# EAGLE design X8-Backplane (EAGLE 7.5.0)
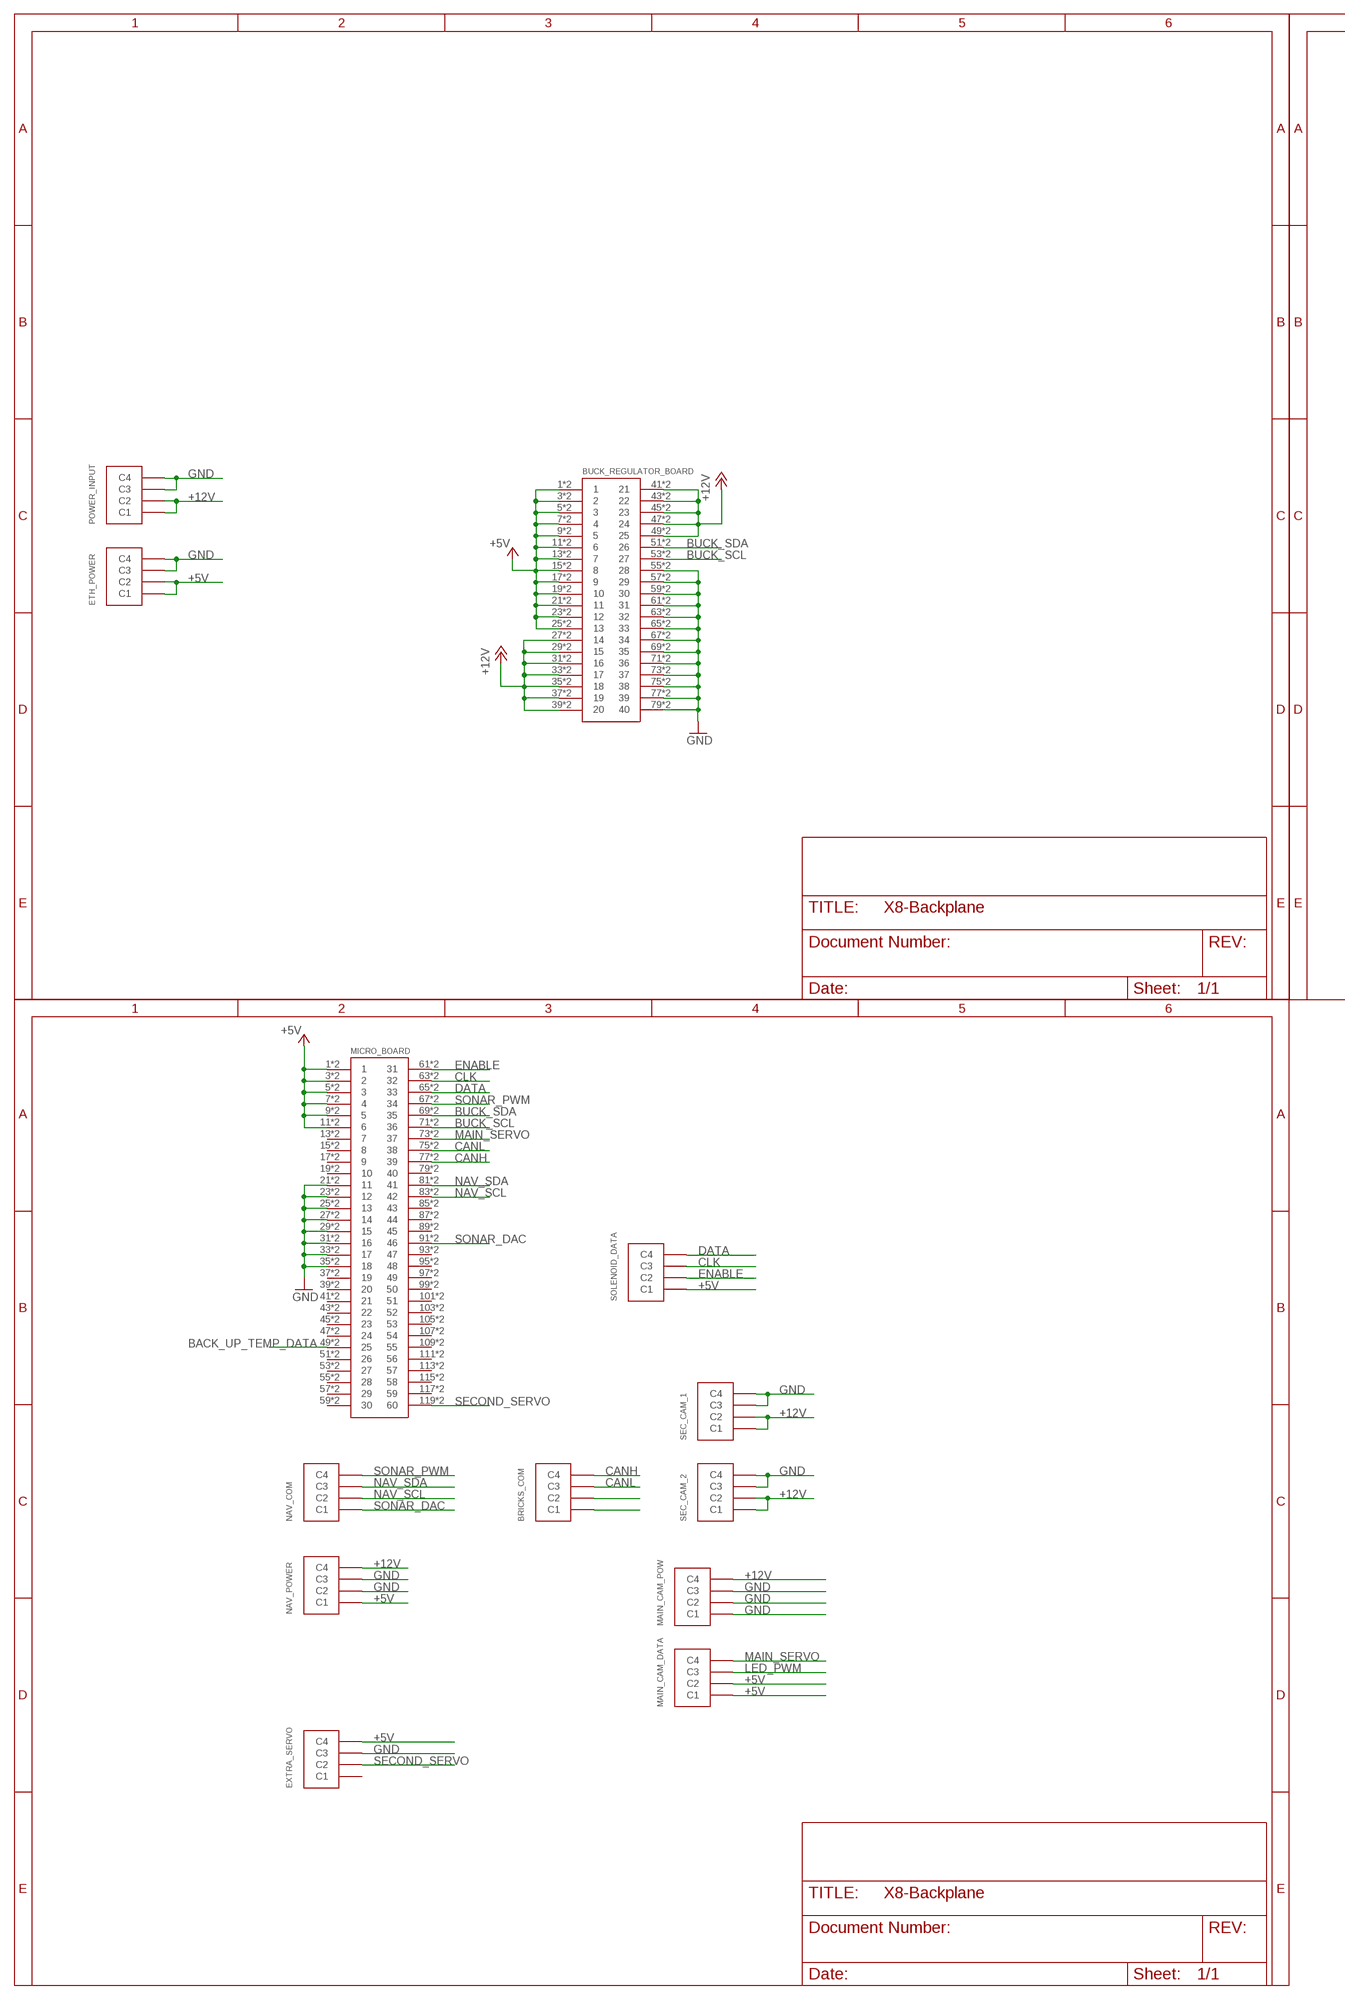
[diagram p0: schematic, sheet 1, part 1 of 2]
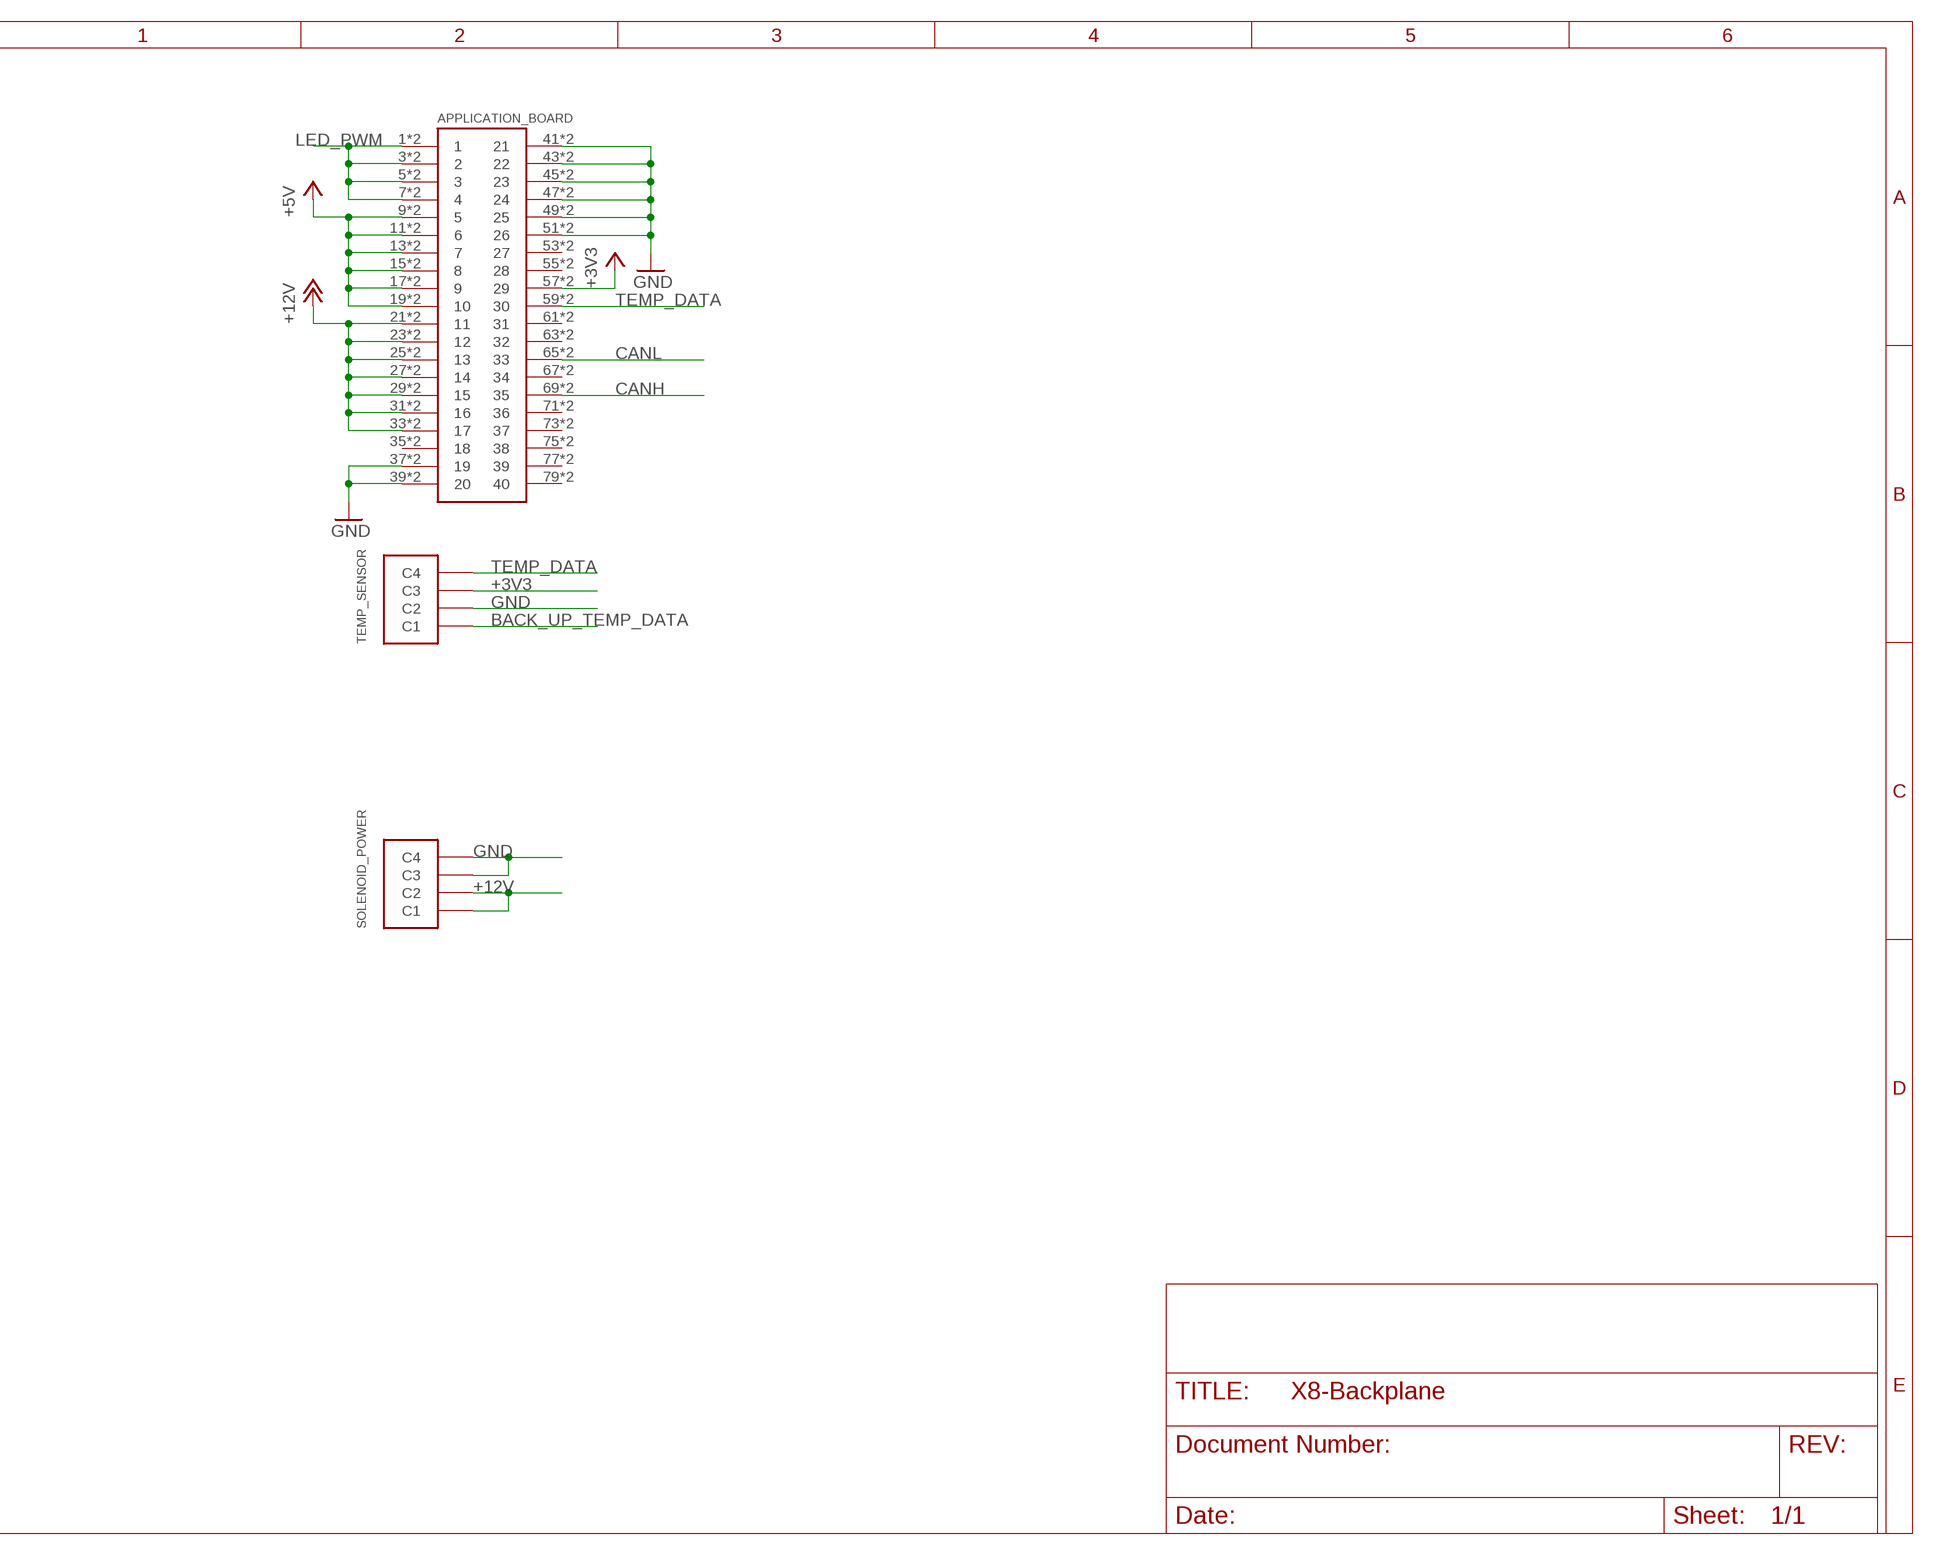
[diagram p1: schematic, sheet 1, part 2 of 2]

## Parts
APPLICATION_BOARD  HSEC8-140-01-XX-DV-A  [HSEC8-140-01-XX-DV-A]
BRICKS_COM  MICRO-FIT-4-SMD-PART  [MICRO-FIT-4-SMD]
BUCK_REGULATOR_BOARD  HSEC8-140-01-XX-DV-A  [HSEC8-140-01-XX-DV-A]
ETH_POWER  MICRO-FIT-4-SMD-PART  [MICRO-FIT-4-SMD]
EXTRA_SERVO  MICRO-FIT-4-SMD-PART  [MICRO-FIT-4-SMD]
MAIN_CAM_DATA  MICRO-FIT-4-SMD-PART  [MICRO-FIT-4-SMD]
MAIN_CAM_POW  MICRO-FIT-4-SMD-PART  [MICRO-FIT-4-SMD]
MICRO_BOARD  HSEC8-160-01-XX-DV-A  [HSEC8-160-01-XX-DV-A]
NAV_COM  MICRO-FIT-4-SMD-PART  [MICRO-FIT-4-SMD]
NAV_POWER  MICRO-FIT-4-SMD-PART  [MICRO-FIT-4-SMD]
POWER_INPUT  MICRO-FIT-4-SMD-PART  [MICRO-FIT-4-SMD]
SEC_CAM_1  MICRO-FIT-4-SMD-PART  [MICRO-FIT-4-SMD]
SEC_CAM_2  MICRO-FIT-4-SMD-PART  [MICRO-FIT-4-SMD]
SOLENOID_DATA  MICRO-FIT-4-SMD-PART  [MICRO-FIT-4-SMD]
SOLENOID_POWER  MICRO-FIT-4-SMD-PART  [MICRO-FIT-4-SMD]
TEMP_SENSOR  MICRO-FIT-4-SMD-PART  [MICRO-FIT-4-SMD]

## Nets
+3V3: APPLICATION_BOARD.57 APPLICATION_BOARD.58 TEMP_SENSOR.C3
+5V: APPLICATION_BOARD.9 APPLICATION_BOARD.10 APPLICATION_BOARD.11 APPLICATION_BOARD.12 APPLICATION_BOARD.13 APPLICATION_BOARD.14 APPLICATION_BOARD.15 APPLICATION_BOARD.16 APPLICATION_BOARD.17 APPLICATION_BOARD.18 APPLICATION_BOARD.19 APPLICATION_BOARD.20 BUCK_REGULATOR_BOARD.1 BUCK_REGULATOR_BOARD.2 BUCK_REGULATOR_BOARD.3 BUCK_REGULATOR_BOARD.4 BUCK_REGULATOR_BOARD.5 BUCK_REGULATOR_BOARD.6 BUCK_REGULATOR_BOARD.7 BUCK_REGULATOR_BOARD.8 BUCK_REGULATOR_BOARD.9 BUCK_REGULATOR_BOARD.10 BUCK_REGULATOR_BOARD.11 BUCK_REGULATOR_BOARD.12 BUCK_REGULATOR_BOARD.13 BUCK_REGULATOR_BOARD.14 BUCK_REGULATOR_BOARD.15 BUCK_REGULATOR_BOARD.16 BUCK_REGULATOR_BOARD.17 BUCK_REGULATOR_BOARD.18 BUCK_REGULATOR_BOARD.19 BUCK_REGULATOR_BOARD.20 BUCK_REGULATOR_BOARD.21 BUCK_REGULATOR_BOARD.22 BUCK_REGULATOR_BOARD.23 BUCK_REGULATOR_BOARD.24 BUCK_REGULATOR_BOARD.25 BUCK_REGULATOR_BOARD.26 ETH_POWER.C1 ETH_POWER.C2 EXTRA_SERVO.C4 MAIN_CAM_DATA.C1 MAIN_CAM_DATA.C2 MICRO_BOARD.1 MICRO_BOARD.2 MICRO_BOARD.3 MICRO_BOARD.4 MICRO_BOARD.5 MICRO_BOARD.6 MICRO_BOARD.7 MICRO_BOARD.8 MICRO_BOARD.9 MICRO_BOARD.10 MICRO_BOARD.11 MICRO_BOARD.12 NAV_POWER.C1 SOLENOID_DATA.C1
+12V: APPLICATION_BOARD.21 APPLICATION_BOARD.22 APPLICATION_BOARD.23 APPLICATION_BOARD.24 APPLICATION_BOARD.25 APPLICATION_BOARD.26 APPLICATION_BOARD.27 APPLICATION_BOARD.28 APPLICATION_BOARD.29 APPLICATION_BOARD.30 APPLICATION_BOARD.31 APPLICATION_BOARD.32 APPLICATION_BOARD.33 APPLICATION_BOARD.34 BUCK_REGULATOR_BOARD.27 BUCK_REGULATOR_BOARD.28 BUCK_REGULATOR_BOARD.29 BUCK_REGULATOR_BOARD.30 BUCK_REGULATOR_BOARD.31 BUCK_REGULATOR_BOARD.32 BUCK_REGULATOR_BOARD.33 BUCK_REGULATOR_BOARD.34 BUCK_REGULATOR_BOARD.35 BUCK_REGULATOR_BOARD.36 BUCK_REGULATOR_BOARD.37 BUCK_REGULATOR_BOARD.38 BUCK_REGULATOR_BOARD.39 BUCK_REGULATOR_BOARD.40 BUCK_REGULATOR_BOARD.41 BUCK_REGULATOR_BOARD.42 BUCK_REGULATOR_BOARD.43 BUCK_REGULATOR_BOARD.44 BUCK_REGULATOR_BOARD.45 BUCK_REGULATOR_BOARD.46 BUCK_REGULATOR_BOARD.47 BUCK_REGULATOR_BOARD.48 BUCK_REGULATOR_BOARD.49 BUCK_REGULATOR_BOARD.50 MAIN_CAM_POW.C4 NAV_POWER.C4 POWER_INPUT.C1 POWER_INPUT.C2 SEC_CAM_1.C1 SEC_CAM_1.C2 SEC_CAM_2.C1 SEC_CAM_2.C2 SOLENOID_POWER.C1 SOLENOID_POWER.C2
BACK_UP_TEMP_DATA: MICRO_BOARD.49 MICRO_BOARD.50 TEMP_SENSOR.C1
BUCK_SCL: BUCK_REGULATOR_BOARD.53 BUCK_REGULATOR_BOARD.54 MICRO_BOARD.71 MICRO_BOARD.72
BUCK_SDA: BUCK_REGULATOR_BOARD.51 BUCK_REGULATOR_BOARD.52 MICRO_BOARD.69 MICRO_BOARD.70
CANH: APPLICATION_BOARD.69 APPLICATION_BOARD.70 BRICKS_COM.C4 MICRO_BOARD.77 MICRO_BOARD.78
CANL: APPLICATION_BOARD.65 APPLICATION_BOARD.66 BRICKS_COM.C3 MICRO_BOARD.75 MICRO_BOARD.76
CLK: MICRO_BOARD.63 MICRO_BOARD.64 SOLENOID_DATA.C3
DATA: MICRO_BOARD.65 MICRO_BOARD.66 SOLENOID_DATA.C4
ENABLE: MICRO_BOARD.61 MICRO_BOARD.62 SOLENOID_DATA.C2
GND: APPLICATION_BOARD.37 APPLICATION_BOARD.38 APPLICATION_BOARD.39 APPLICATION_BOARD.40 APPLICATION_BOARD.41 APPLICATION_BOARD.42 APPLICATION_BOARD.43 APPLICATION_BOARD.44 APPLICATION_BOARD.45 APPLICATION_BOARD.46 APPLICATION_BOARD.47 APPLICATION_BOARD.48 APPLICATION_BOARD.49 APPLICATION_BOARD.50 APPLICATION_BOARD.51 APPLICATION_BOARD.52 BUCK_REGULATOR_BOARD.55 BUCK_REGULATOR_BOARD.56 BUCK_REGULATOR_BOARD.57 BUCK_REGULATOR_BOARD.58 BUCK_REGULATOR_BOARD.59 BUCK_REGULATOR_BOARD.60 BUCK_REGULATOR_BOARD.61 BUCK_REGULATOR_BOARD.62 BUCK_REGULATOR_BOARD.63 BUCK_REGULATOR_BOARD.64 BUCK_REGULATOR_BOARD.65 BUCK_REGULATOR_BOARD.66 BUCK_REGULATOR_BOARD.67 BUCK_REGULATOR_BOARD.68 BUCK_REGULATOR_BOARD.69 BUCK_REGULATOR_BOARD.70 BUCK_REGULATOR_BOARD.71 BUCK_REGULATOR_BOARD.72 BUCK_REGULATOR_BOARD.73 BUCK_REGULATOR_BOARD.74 BUCK_REGULATOR_BOARD.75 BUCK_REGULATOR_BOARD.76 BUCK_REGULATOR_BOARD.77 BUCK_REGULATOR_BOARD.78 BUCK_REGULATOR_BOARD.79 BUCK_REGULATOR_BOARD.80 ETH_POWER.C3 ETH_POWER.C4 EXTRA_SERVO.C3 MAIN_CAM_POW.C1 MAIN_CAM_POW.C2 MAIN_CAM_POW.C3 MICRO_BOARD.21 MICRO_BOARD.22 MICRO_BOARD.23 MICRO_BOARD.24 MICRO_BOARD.25 MICRO_BOARD.26 MICRO_BOARD.27 MICRO_BOARD.28 MICRO_BOARD.29 MICRO_BOARD.30 MICRO_BOARD.31 MICRO_BOARD.32 MICRO_BOARD.33 MICRO_BOARD.34 MICRO_BOARD.35 MICRO_BOARD.36 NAV_POWER.C2 NAV_POWER.C3 POWER_INPUT.C3 POWER_INPUT.C4 SEC_CAM_1.C3 SEC_CAM_1.C4 SEC_CAM_2.C3 SEC_CAM_2.C4 SOLENOID_POWER.C3 SOLENOID_POWER.C4 TEMP_SENSOR.C2
LED_PWM: APPLICATION_BOARD.1 APPLICATION_BOARD.2 APPLICATION_BOARD.3 APPLICATION_BOARD.4 APPLICATION_BOARD.5 APPLICATION_BOARD.6 APPLICATION_BOARD.7 APPLICATION_BOARD.8 MAIN_CAM_DATA.C3
MAIN_SERVO: MAIN_CAM_DATA.C4 MICRO_BOARD.73 MICRO_BOARD.74
N$3: BRICKS_COM.C2
N$5: BRICKS_COM.C1
NAV_SCL: MICRO_BOARD.83 MICRO_BOARD.84 NAV_COM.C2
NAV_SDA: MICRO_BOARD.81 MICRO_BOARD.82 NAV_COM.C3
SECOND_SERVO: EXTRA_SERVO.C2 MICRO_BOARD.119 MICRO_BOARD.120
SONAR_DAC: MICRO_BOARD.91 MICRO_BOARD.92 NAV_COM.C1
SONAR_PWM: MICRO_BOARD.67 MICRO_BOARD.68 NAV_COM.C4
TEMP_DATA: APPLICATION_BOARD.59 APPLICATION_BOARD.60 TEMP_SENSOR.C4
Unconnected: APPLICATION_BOARD.35 APPLICATION_BOARD.36 APPLICATION_BOARD.53 APPLICATION_BOARD.54 APPLICATION_BOARD.55 APPLICATION_BOARD.56 APPLICATION_BOARD.61 APPLICATION_BOARD.62 APPLICATION_BOARD.63 APPLICATION_BOARD.64 APPLICATION_BOARD.67 APPLICATION_BOARD.68 APPLICATION_BOARD.71 APPLICATION_BOARD.72 APPLICATION_BOARD.73 APPLICATION_BOARD.74 APPLICATION_BOARD.75 APPLICATION_BOARD.76 APPLICATION_BOARD.77 APPLICATION_BOARD.78 APPLICATION_BOARD.79 APPLICATION_BOARD.80 EXTRA_SERVO.C1 MICRO_BOARD.13 MICRO_BOARD.14 MICRO_BOARD.15 MICRO_BOARD.16 MICRO_BOARD.17 MICRO_BOARD.18 MICRO_BOARD.19 MICRO_BOARD.20 MICRO_BOARD.37 MICRO_BOARD.38 MICRO_BOARD.39 MICRO_BOARD.40 MICRO_BOARD.41 MICRO_BOARD.42 MICRO_BOARD.43 MICRO_BOARD.44 MICRO_BOARD.45 MICRO_BOARD.46 MICRO_BOARD.47 MICRO_BOARD.48 MICRO_BOARD.51 MICRO_BOARD.52 MICRO_BOARD.53 MICRO_BOARD.54 MICRO_BOARD.55 MICRO_BOARD.56 MICRO_BOARD.57 MICRO_BOARD.58 MICRO_BOARD.59 MICRO_BOARD.60 MICRO_BOARD.79 MICRO_BOARD.80 MICRO_BOARD.85 MICRO_BOARD.86 MICRO_BOARD.87 MICRO_BOARD.88 MICRO_BOARD.89 MICRO_BOARD.90 MICRO_BOARD.93 MICRO_BOARD.94 MICRO_BOARD.95 MICRO_BOARD.96 MICRO_BOARD.97 MICRO_BOARD.98 MICRO_BOARD.99 MICRO_BOARD.100 MICRO_BOARD.101 MICRO_BOARD.102 MICRO_BOARD.103 MICRO_BOARD.104 MICRO_BOARD.105 MICRO_BOARD.106 MICRO_BOARD.107 MICRO_BOARD.108 MICRO_BOARD.109 MICRO_BOARD.110 MICRO_BOARD.111 MICRO_BOARD.112 MICRO_BOARD.113 MICRO_BOARD.114 MICRO_BOARD.115 MICRO_BOARD.116 MICRO_BOARD.117 MICRO_BOARD.118

## Library data of the parts
APPLICATION_BOARD BUCK_REGULATOR_BOARD = HSEC8-1xx-01-XX-DV-A:HSEC8-140-01-XX-DV-A
BRICKS_COM ETH_POWER EXTRA_SERVO MAIN_CAM_DATA MAIN_CAM_POW NAV_COM NAV_POWER POWER_INPUT SEC_CAM_1 SEC_CAM_2 SOLENOID_DATA SOLENOID_POWER TEMP_SENSOR = Connectors:MICRO-FIT-4-SMD: 4 Pin Molex connector; DIGIKEY-CONTACT-PN: WM1125CT-ND; DIGIKEY-FEMALE-PN: WM2640CT-ND; DIGIKEY-MALE-PN: WM1847-ND
MICRO_BOARD = HSEC8-1xx-01-XX-DV-A:HSEC8-160-01-XX-DV-A

## Board
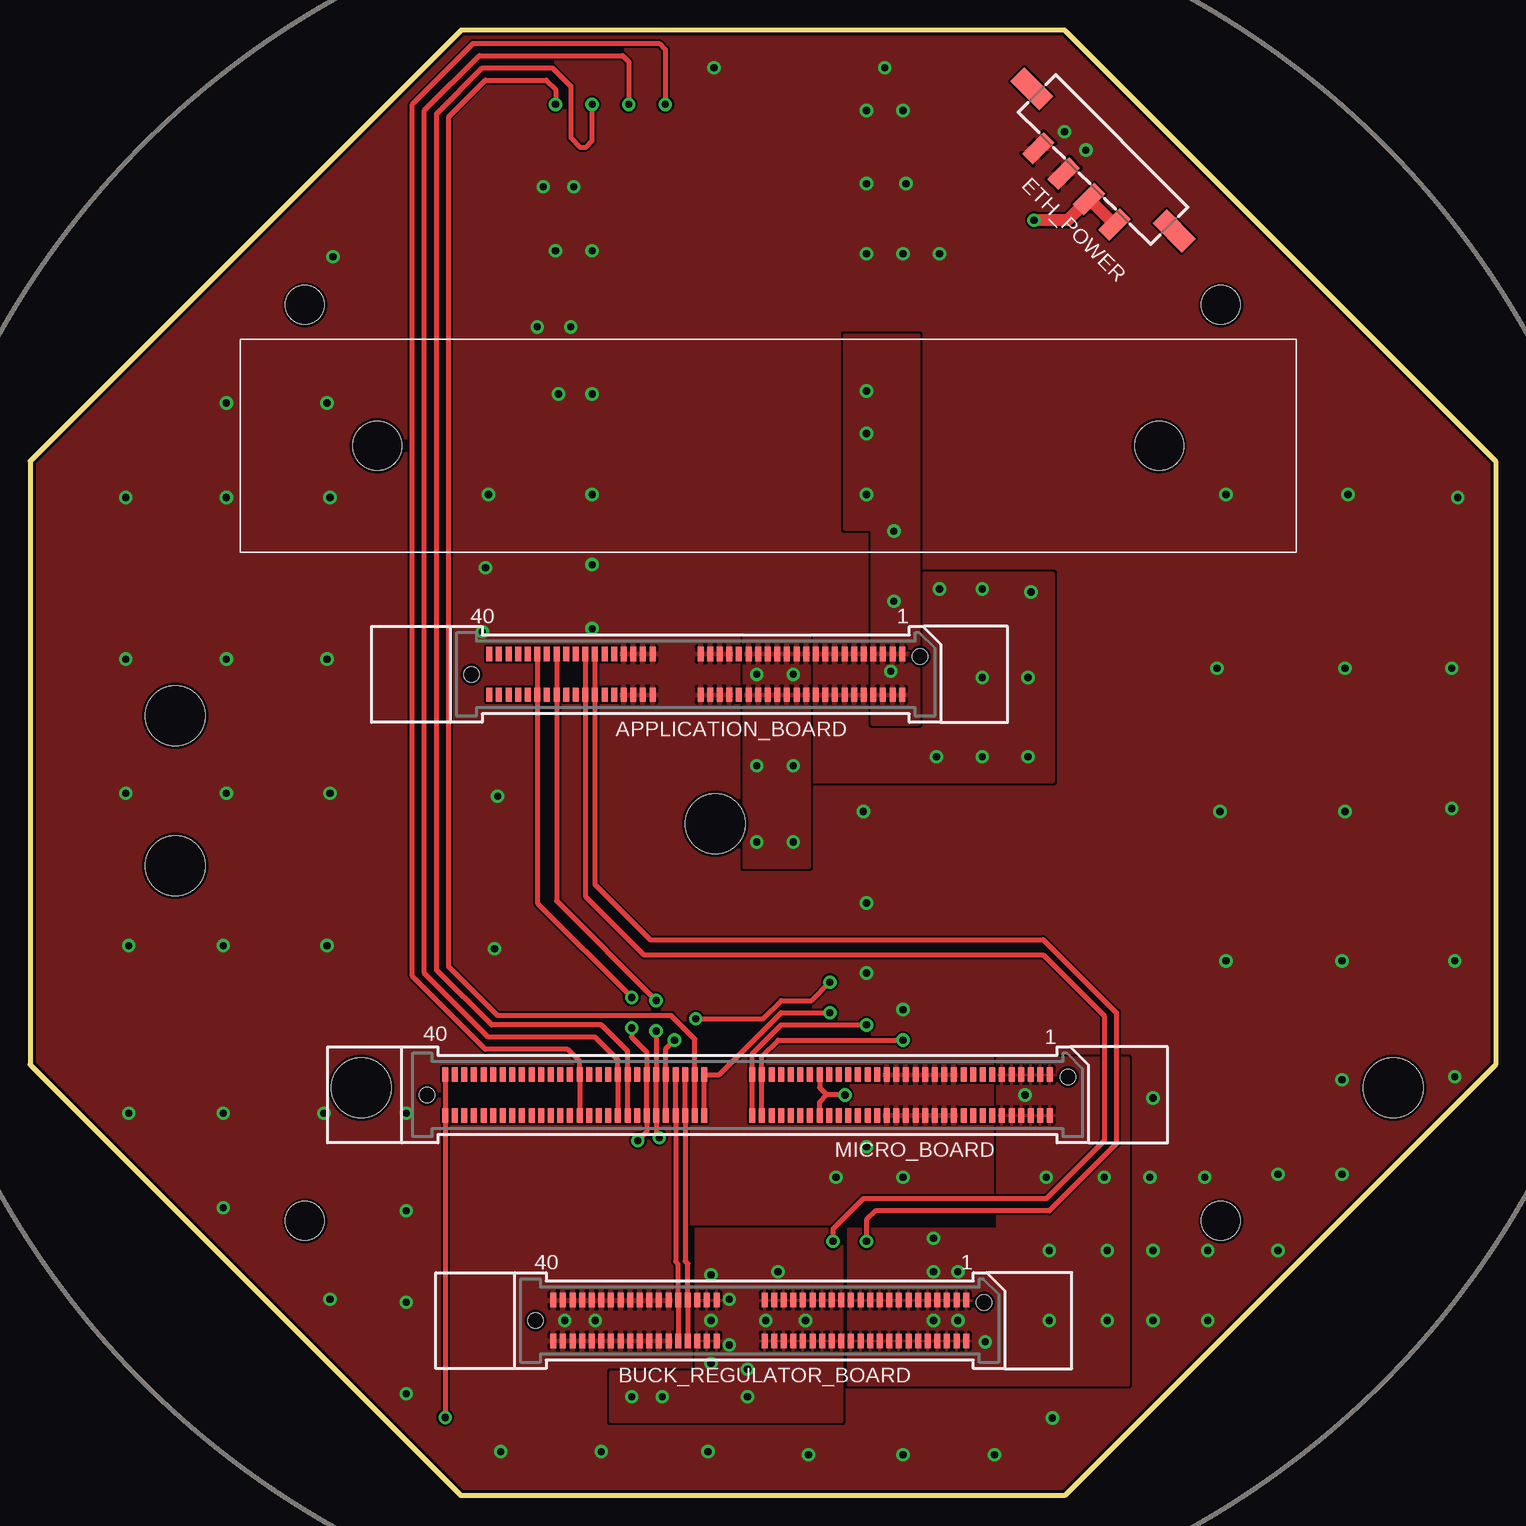
[diagram p2: board, top side]
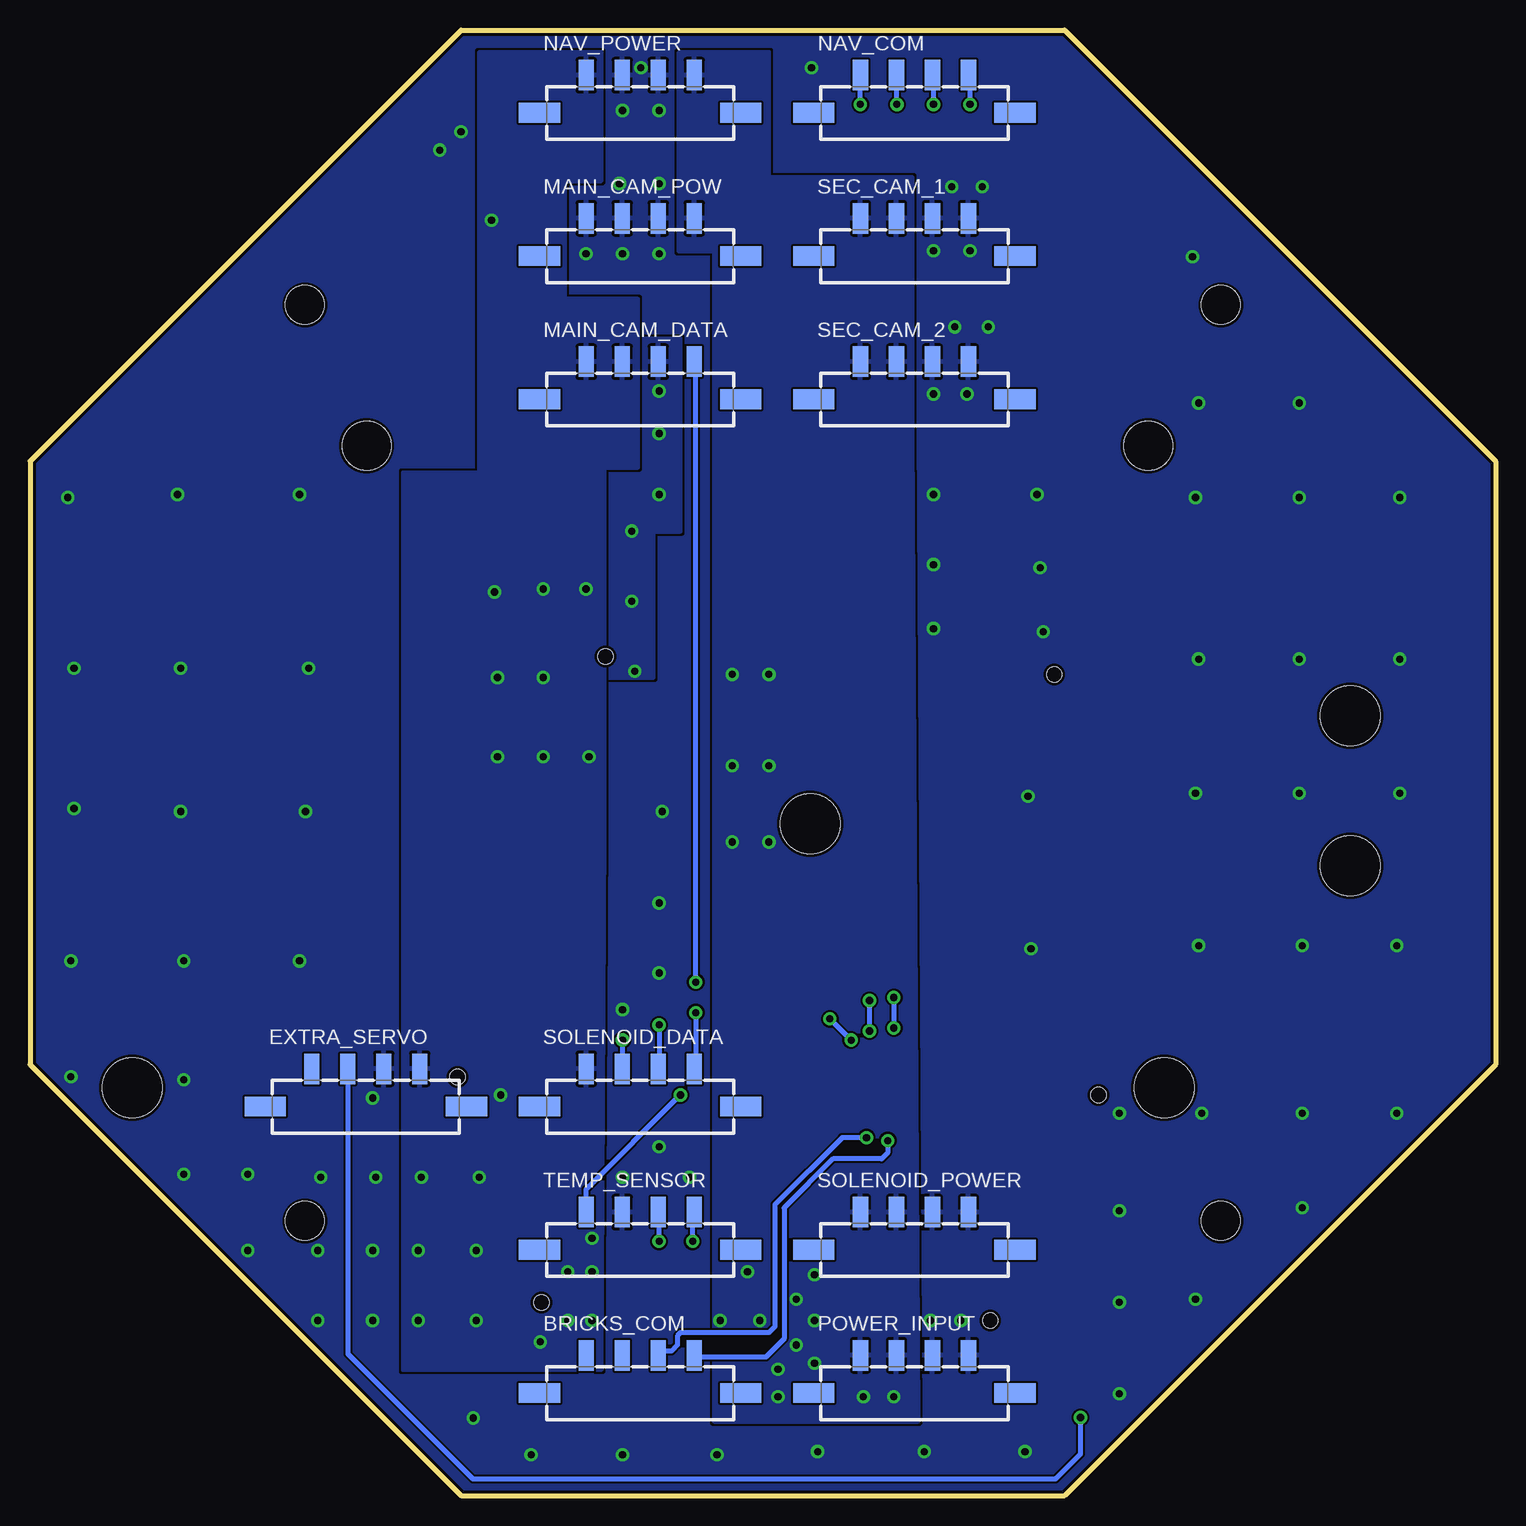
[diagram p3: board, bottom side, seen from below]

Size 122.13 x 122.13 mm. Coordinates in mm from the lower left corner, seen from the top.
Outline: 35.92,122.13 0,86.21 0,35.92 35.92,0 86.21,0 122.13,35.92 122.13,86.21 86.21,122.13 35.92,122.13
Copper layers (1*16): Top 0.035mm / dielectric 1.5mm / Bottom 0.035mm
Design rules "GoldPhoenix": minimum track width 7mil, minimum drill 10mil, track to track 7mil, track to pad 7mil, pad to pad 7mil, via to via 7mil, smd to smd 7mil, copper to edge 10mil, drill to drill 8mil, minimum pad ring 10mil, minimum via ring 10mil, stop-mask expansion 4mil, vias tented up to drill 25mil, thermal gap 10mil
Holes 3.2 mm at 22.9,99.23 22.9,22.9 99.23,22.9 99.23,99.23
Holes 5 mm at 27.61,33.98 12.11,52.48 12.11,64.98 113.61,33.98 57.11,55.98

### Footprints (pad centres in the part's own frame; a part is rotated, then mirrored left to right if it is on the bottom)
HSEC8-140-01-XX-DV-A = smd 0.5 x 1.2: 1 -17.2,-1.7; 2 -17.2,1.7; 3 -16.4,-1.7; 4 -16.4,1.7; 5 -15.6,-1.7; 6 -15.6,1.7; 7 -14.8,-1.7; 8 -14.8,1.7; 9 -14,-1.7; 10 -14,1.7; 11 -13.2,-1.7; 12 -13.2,1.7; 13 -12.4,-1.7; 14 -12.4,1.7; 15 -11.6,-1.7; 16 -11.6,1.7; 17 -10.8,-1.7; 18 -10.8,1.7; 19 -10,-1.7; 20 -10,1.7; 21 -9.2,-1.7; 22 -9.2,1.7; 23 -8.4,-1.7; 24 -8.4,1.7; 25 -7.6,-1.7; 26 -7.6,1.7; 27 -6.8,-1.7; 28 -6.8,1.7; 29 -6,-1.7; 30 -6,1.7; 31 -5.2,-1.7; 32 -5.2,1.7; 33 -4.4,-1.7; 34 -4.4,1.7; 35 -3.6,-1.7; 36 -3.6,1.7; 37 -2.8,-1.7; 38 -2.8,1.7; 39 -2,-1.7; 40 -2,1.7; 41 -1.2,-1.7; 42 -1.2,1.7; 43 -0.4,-1.7; 44 -0.4,1.7; 45 3.6,-1.7; 46 3.6,1.7; 47 4.4,-1.7; 48 4.4,1.7; 49 5.2,-1.7; 50 5.2,1.7; 51 6,-1.7; 52 6,1.7; 53 6.8,-1.7; 54 6.8,1.7; 55 7.6,-1.7; 56 7.6,1.7; 57 8.4,-1.7; 58 8.4,1.7; 59 9.2,-1.7; 60 9.2,1.7; 61 10,-1.7; 62 10,1.7; 63 10.8,-1.7; 64 10.8,1.7; 65 11.6,-1.7; 66 11.6,1.7; 67 12.4,-1.7; 68 12.4,1.7; 69 13.2,-1.7; 70 13.2,1.7; 71 14,-1.7; 72 14,1.7; 73 14.8,-1.7; 74 14.8,1.7; 75 15.6,-1.7; 76 15.6,1.7; 77 16.4,-1.7; 78 16.4,1.7; 79 17.2,-1.7; 80 17.2,1.7 | hole 1.27: -18.7,-1.5; 18.7,0
MICRO-FIT-4-SMD = smd 1.27 x 2.54: C1 5.6,3.955; C2 8.6,3.955; C3 11.6,3.955; C4 14.6,3.955 | smd 3.43 x 1.65: NC1 1.715,0.825; NC2 18.485,0.825
HSEC8-160-01-XX-DV-A = smd 0.5 x 1.2: 1 -25.2,-1.7; 2 -25.2,1.7; 3 -24.4,-1.7; 4 -24.4,1.7; 5 -23.6,-1.7; 6 -23.6,1.7; 7 -22.8,-1.7; 8 -22.8,1.7; 9 -22,-1.7; 10 -22,1.7; 11 -21.2,-1.7; 12 -21.2,1.7; 13 -20.4,-1.7; 14 -20.4,1.7; 15 -19.6,-1.7; 16 -19.6,1.7; 17 -18.8,-1.7; 18 -18.8,1.7; 19 -18,-1.7; 20 -18,1.7; 21 -17.2,-1.7; 22 -17.2,1.7; 23 -16.4,-1.7; 24 -16.4,1.7; 25 -15.6,-1.7; 26 -15.6,1.7; 27 -14.8,-1.7; 28 -14.8,1.7; 29 -14,-1.7; 30 -14,1.7; 31 -13.2,-1.7; 32 -13.2,1.7; 33 -12.4,-1.7; 34 -12.4,1.7; 35 -11.6,-1.7; 36 -11.6,1.7; 37 -10.8,-1.7; 38 -10.8,1.7; 39 -10,-1.7; 40 -10,1.7; 41 -9.2,-1.7; 42 -9.2,1.7; 43 -8.4,-1.7; 44 -8.4,1.7; 45 -7.6,-1.7; 46 -7.6,1.7; 47 -6.8,-1.7; 48 -6.8,1.7; 49 -6,-1.7; 50 -6,1.7; 51 -5.2,-1.7; 52 -5.2,1.7; 53 -4.4,-1.7; 54 -4.4,1.7; 55 -3.6,-1.7; 56 -3.6,1.7; 57 -2.8,-1.7; 58 -2.8,1.7; 59 -2,-1.7; 60 -2,1.7; 61 -1.2,-1.7; 62 -1.2,1.7; 63 -0.4,-1.7; 64 -0.4,1.7; 65 3.6,-1.7; 66 3.6,1.7; 67 4.4,-1.7; 68 4.4,1.7; 69 5.2,-1.7; 70 5.2,1.7; 71 6,-1.7; 72 6,1.7; 73 6.8,-1.7; 74 6.8,1.7; 75 7.6,-1.7; 76 7.6,1.7; 77 8.4,-1.7; 78 8.4,1.7; 79 9.2,-1.7; 80 9.2,1.7; 81 10,-1.7; 82 10,1.7; 83 10.8,-1.7; 84 10.8,1.7; 85 11.6,-1.7; 86 11.6,1.7; 87 12.4,-1.7; 88 12.4,1.7; 89 13.2,-1.7; 90 13.2,1.7; 91 14,-1.7; 92 14,1.7; 93 14.8,-1.7; 94 14.8,1.7; 95 15.6,-1.7; 96 15.6,1.7; 97 16.4,-1.7; 98 16.4,1.7; 99 17.2,-1.7; 100 17.2,1.7; 101 18,-1.7; 102 18,1.7; 103 18.8,-1.7; 104 18.8,1.7; 105 19.6,-1.7; 106 19.6,1.7; 107 20.4,-1.7; 108 20.4,1.7; 109 21.2,-1.7; 110 21.2,1.7; 111 22,-1.7; 112 22,1.7; 113 22.8,-1.7; 114 22.8,1.7; 115 23.6,-1.7; 116 23.6,1.7; 117 24.4,-1.7; 118 24.4,1.7; 119 25.2,-1.7; 120 25.2,1.7 | hole 1.27: -26.7,-1.5; 26.7,0
ETH_SWITCH = hole 4.064: 76.581,8.89; 11.43,8.89

### Placement (x,y rotation side)
APPLICATION_BOARD  55.48,68.43 180 top
BRICKS_COM  81.39,7.73 0 bottom
BUCK_REGULATOR_BOARD  60.81,14.59 180 top
ETH_POWER  97.13,104.76 135 top
EXTRA_SERVO  104.25,31.6 0 bottom
MAIN_CAM_DATA  81.39,90.53 0 bottom
MAIN_CAM_POW  81.39,102.47 0 bottom
MICRO_BOARD  59.8,33.38 180 top
NAV_COM  58.53,114.41 0 bottom
NAV_POWER  81.39,114.41 0 bottom
POWER_INPUT  58.53,7.73 0 bottom
SEC_CAM_1  58.53,102.47 0 bottom
SEC_CAM_2  58.53,90.53 0 bottom
SOLENOID_DATA  81.39,31.6 0 bottom
SOLENOID_POWER  58.53,19.67 0 bottom
TEMP_SENSOR  81.39,19.67 0 bottom
U$18  [ETH_SWITCH]  105.52,96.37 180 top

### Tracks (layer width: path | path; a pad name or v marks a point on that pad's centre or on a via)
+3V3  (via drill 0.6)
  Top 0.406: APPLICATION_BOARD.57 APPLICATION_BOARD.58 47.08,50.93 51.67,46.34 84.43,46.34 90.53,40.24 90.53,29.32 84.94,23.73 70.46,23.73 69.7,22.97 v69.7,21.19
  Bottom 0.406: v69.7,21.19 69.7,23.54 TEMP_SENSOR.C3
+5V  (via drill 0.6)
  Top 1.016: ETH_POWER.C1 ETH_POWER.C2 86.5,106.28 v83.67,106.28
  other vias: 84.94,20.43 75.29,14.59 77.32,14.59 75.29,18.65 77.32,18.65 75.29,21.44 89.77,20.43 84.94,14.59 89.77,14.59 79.61,12.81 84.69,26.52 89.51,26.52 82.91,33.38 75.8,75.55 83.42,75.29 79.35,68.18 79.35,75.55 83.16,68.18 83.16,61.58 79.35,61.58 75.54,61.58
  pour Bottom: 91.04,10.52 74.53,10.52 74.27,55.48 91.04,55.48
  pour Bottom: 74.27,53.96 74.27,85.71 71.48,85.71 71.48,99.68 77.58,99.68 77.58,109.58 74.53,109.58 74.53,120.25 84.69,120.25 84.69,85.2 91.04,85.2 91.04,53.96
  pour Top: 68.18,22.21 68.18,9.25 91.55,9.25 91.55,22.21
  pour Top: 80.62,36.43 80.62,21.95 91.55,21.95 91.55,36.43
  pour Top (rank 4): 65.38,71.48 69.96,71.48 69.96,63.86 74.53,63.86 74.53,76.82 85.2,76.82 85.2,59.54 65.38,59.54
+12V  (via drill 0.6)
  other vias: 56.75,14.59 58.27,16.36 58.27,12.55 56.75,11.03 56.75,18.4 50.14,8.24 52.68,8.24 61.32,14.59 64.62,14.59 59.8,10.52 59.8,8.24 60.56,68.43 63.61,68.43 60.56,60.81 63.61,60.81 60.56,54.46 63.61,54.46 62.34,18.65
  pour Bottom (rank 2): 60.56,120.25 68.05,120.22 68.05,103.71 65.13,103.74 65.13,87.99 48.62,87.99 48.62,109.84 60.56,109.84
  pour Bottom (rank 2): 48.11,6.2 48.62,88.75 65.13,88.5 65.13,6.2
  pour Top (rank 2): 67.67,6.2 67.67,22.21 55.48,22.21 55.48,10.27 48.37,10.27 48.37,6.2
  pour Top (rank 3): 59.54,71.48 59.54,52.43 64.88,52.43 64.88,71.48
BACK_UP_TEMP_DATA  (via drill 0.6)
  Top 0.406: v67.92,33.38 66.4,33.38 | MICRO_BOARD.49 65.8,33.99 66.4,33.38 | MICRO_BOARD.50 65.8,32.78 66.4,33.38
  Bottom 0.406: TEMP_SENSOR.C1 75.79,25.52 v67.92,33.38
BUCK_SCL
  Top 0.406: BUCK_REGULATOR_BOARD.54 BUCK_REGULATOR_BOARD.53 54.01,19.29 53.8,19.51 MICRO_BOARD.72 MICRO_BOARD.71
BUCK_SDA
  Top 0.406: BUCK_REGULATOR_BOARD.52 BUCK_REGULATOR_BOARD.51 54.81,19.33 54.6,19.55 | MICRO_BOARD.69 MICRO_BOARD.70 54.6,19.55 | 54.6,19.55 54.59,19.54
CANH  (via drill 0.6)
  Top 0.406: v50.65,29.57 51.4,30.32 MICRO_BOARD.78 MICRO_BOARD.77 51.41,35.1 51.41,36.94 50.14,38.21 v50.14,38.97 | APPLICATION_BOARD.69 APPLICATION_BOARD.70 42.28,49.38 v50.14,41.51
  Bottom 0.406: v50.65,29.57 50.65,28.56 51.16,28.05 55.22,28.05 59.29,23.98 59.29,13.06 60.81,11.54 66.64,11.54 BRICKS_COM.C4 | v50.14,41.51 v50.14,38.97
CANL  (via drill 0.6)
  Top 0.406: v52.43,29.83 52.2,30.06 MICRO_BOARD.76 MICRO_BOARD.75 52.18,35.1 v52.18,38.72 | APPLICATION_BOARD.65 APPLICATION_BOARD.66 43.88,49.55 v52.18,41.26
  Bottom 0.406: v52.43,29.83 54.46,29.83 60.05,24.24 60.05,14.08 60.56,13.57 67.92,13.57 68.18,13.32 68.18,12.55 68.69,12.05 69.42,12.05 BRICKS_COM.C3 | v52.18,41.26 v52.18,38.72
CLK  (via drill 0.6)
  Top 0.406: MICRO_BOARD.64 MICRO_BOARD.63 60.2,36.83 62.59,39.22 v69.7,39.22
  Bottom 0.406: v69.7,39.22 69.7,35.64 SOLENOID_DATA.C3
DATA  (via drill 0.6)
  Top 0.406: MICRO_BOARD.66 MICRO_BOARD.65 57.43,35.08 62.59,40.24 v66.65,40.24
  Bottom 0.406: v66.65,40.24 66.65,35.69 SOLENOID_DATA.C4
ENABLE  (via drill 0.6)
  Top 0.406: MICRO_BOARD.62 MICRO_BOARD.61 61,36.61 62.34,37.95 v72.75,37.95
  Bottom 0.406: v72.75,37.95 72.79,37.92 SOLENOID_DATA.C2
GND  (via drill 0.6)
  other vias: 39.22,3.66 47.6,3.66 56.49,3.66 64.88,3.41 72.75,3.41 80.37,3.41 85.2,6.46 93.58,14.59 93.58,20.43 93.32,26.52 93.58,33.13 47.1,14.59 44.56,14.59 31.35,8.49 31.35,16.11 25,16.36 31.35,23.73 16.11,23.98 8.23,31.86 16.11,31.86 24.49,31.86 31.35,31.86 69.7,115.42 72.75,115.42 69.7,103.49 72.75,103.49 75.8,103.49 69.7,109.33 73,109.33 57,118.98 71.23,118.98 45.32,109.07 42.78,109.07 46.84,103.74 43.79,103.74 45.06,97.39 42.27,97.39 46.84,91.8 44.05,91.8 86.21,113.65 87.99,112.12 98.15,14.59 98.15,20.43 103.99,20.43 97.9,26.52 103.99,26.78 109.33,26.78 118.72,34.91 109.33,34.65 8.23,45.83 16.11,45.83 24.74,45.83 7.98,58.53 16.36,58.53 25,58.53 7.98,69.7 16.36,69.7 24.74,69.7 7.98,83.17 16.36,83.17 25,83.17 118.72,44.56 109.33,44.56 99.67,44.56 99.17,57 98.91,68.94 99.67,83.42 109.58,57 118.47,57.26 109.58,68.94 118.47,68.94 109.83,83.42 118.98,83.17 16.36,91.04 24.74,91.04 25.25,103.23 38.21,83.42 46.84,83.42 37.95,77.32 46.84,77.58 38.97,58.27 38.71,45.57 46.84,72.24 37.7,71.99 72.75,26.52 67.16,26.52 69.7,29.06 72.75,40.49 69.7,43.54 69.7,49.38 69.45,57
  pour Bottom (rank 6): 35.92,122.28 86.21,122.28 122.28,86.21 122.28,35.92 86.21,-0.15 35.92,-0.15 -0.15,35.92 -0.15,86.21
  pour Top (rank 6): -0.15,86.21 35.92,122.28 86.47,122.28 122.28,86.47 122.28,35.92 86.21,-0.15 35.92,-0.15 -0.15,35.92
LED_PWM  (via drill 0.6)
  other vias: 71.73,68.69 71.99,80.37 69.7,83.42 69.7,88.5 69.7,92.06 71.99,74.53
  pour Bottom (rank 2): 67.92,96.37 71.23,96.37 71.23,85.45 74.02,85.45 74.02,68.18 70.21,68.18 70.21,80.37 67.92,80.37
  pour Top: 70.21,64.37 74.02,64.37 74.02,96.63 67.92,96.63 67.92,80.63 70.21,80.63
MAIN_SERVO  (via drill 0.6)
  Top 0.406: MICRO_BOARD.74 MICRO_BOARD.73 53,37.25 v53.7,37.95 | v66.65,42.78 65.13,41.26 62.59,41.26 61.07,39.73 v55.48,39.73
  Bottom 0.406: v53.7,37.95 v55.48,39.73 | v66.65,42.78 66.65,94.36 MAIN_CAM_DATA.C4
NAV_SCL  (via drill 0.6)
  Top 0.406: MICRO_BOARD.84 MICRO_BOARD.83 49,36.31 47.1,38.21 38.21,38.21 32.87,43.54 32.87,115.42 37.44,120 49.38,120 49.89,119.49 v49.89,115.93
  Bottom 0.406: v49.89,115.93 49.89,118.33 NAV_COM.C2
NAV_SDA  (via drill 0.6)
  Top 0.406: MICRO_BOARD.82 MICRO_BOARD.81 49.8,37.03 47.6,39.22 38.46,39.22 33.89,43.8 33.89,115.17 37.7,118.98 43.54,118.98 45.06,117.46 45.06,113.14 45.83,112.38 46.33,112.38 46.84,112.88 v46.84,115.93
  Bottom 0.406: NAV_COM.C3 46.84,118.28 v46.84,115.93
SECOND_SERVO  (via drill 0.6)
  Top 0.406: MICRO_BOARD.120 MICRO_BOARD.119 v34.6,6.51
  Bottom 0.406: v34.6,6.51 34.6,3.46 36.68,1.38 85.2,1.38 95.61,11.79 95.61,35.52 EXTRA_SERVO.C2
SONAR_DAC  (via drill 0.6)
  Top 0.406: MICRO_BOARD.92 MICRO_BOARD.91 45.8,36.21 44.81,37.19 37.95,37.19 31.86,43.29 31.86,115.93 36.94,121.01 52.43,121.01 52.94,120.5 v52.94,115.93
  Bottom 0.406: v52.94,115.93 52.94,118.35 NAV_COM.C1
SONAR_PWM  (via drill 0.6)
  Top 0.406: MICRO_BOARD.68 MICRO_BOARD.67 55.4,38.04 53.45,39.99 38.97,39.99 34.9,44.05 34.9,114.92 37.95,117.96 43.03,117.96 43.79,117.2 v43.79,115.93
  Bottom 0.406: v43.79,115.93 43.79,118.23 NAV_COM.C4
TEMP_DATA  (via drill 0.6)
  Top 0.406: APPLICATION_BOARD.59 APPLICATION_BOARD.60 46.28,49.95 51.16,45.07 84.43,45.07 89.51,39.99 89.51,29.57 84.69,24.75 69.45,24.75 66.91,22.21 v66.91,21.19
  Bottom 0.406: v66.91,21.19 66.91,23.5 TEMP_SENSOR.C4